# Altium schematic sheet led_frontend.SchDoc: SDL - LED frontend
size Letter; Author: Ye-Sheng Kuo; Revision: 1; SheetNumber: 1; SheetTotal: 1
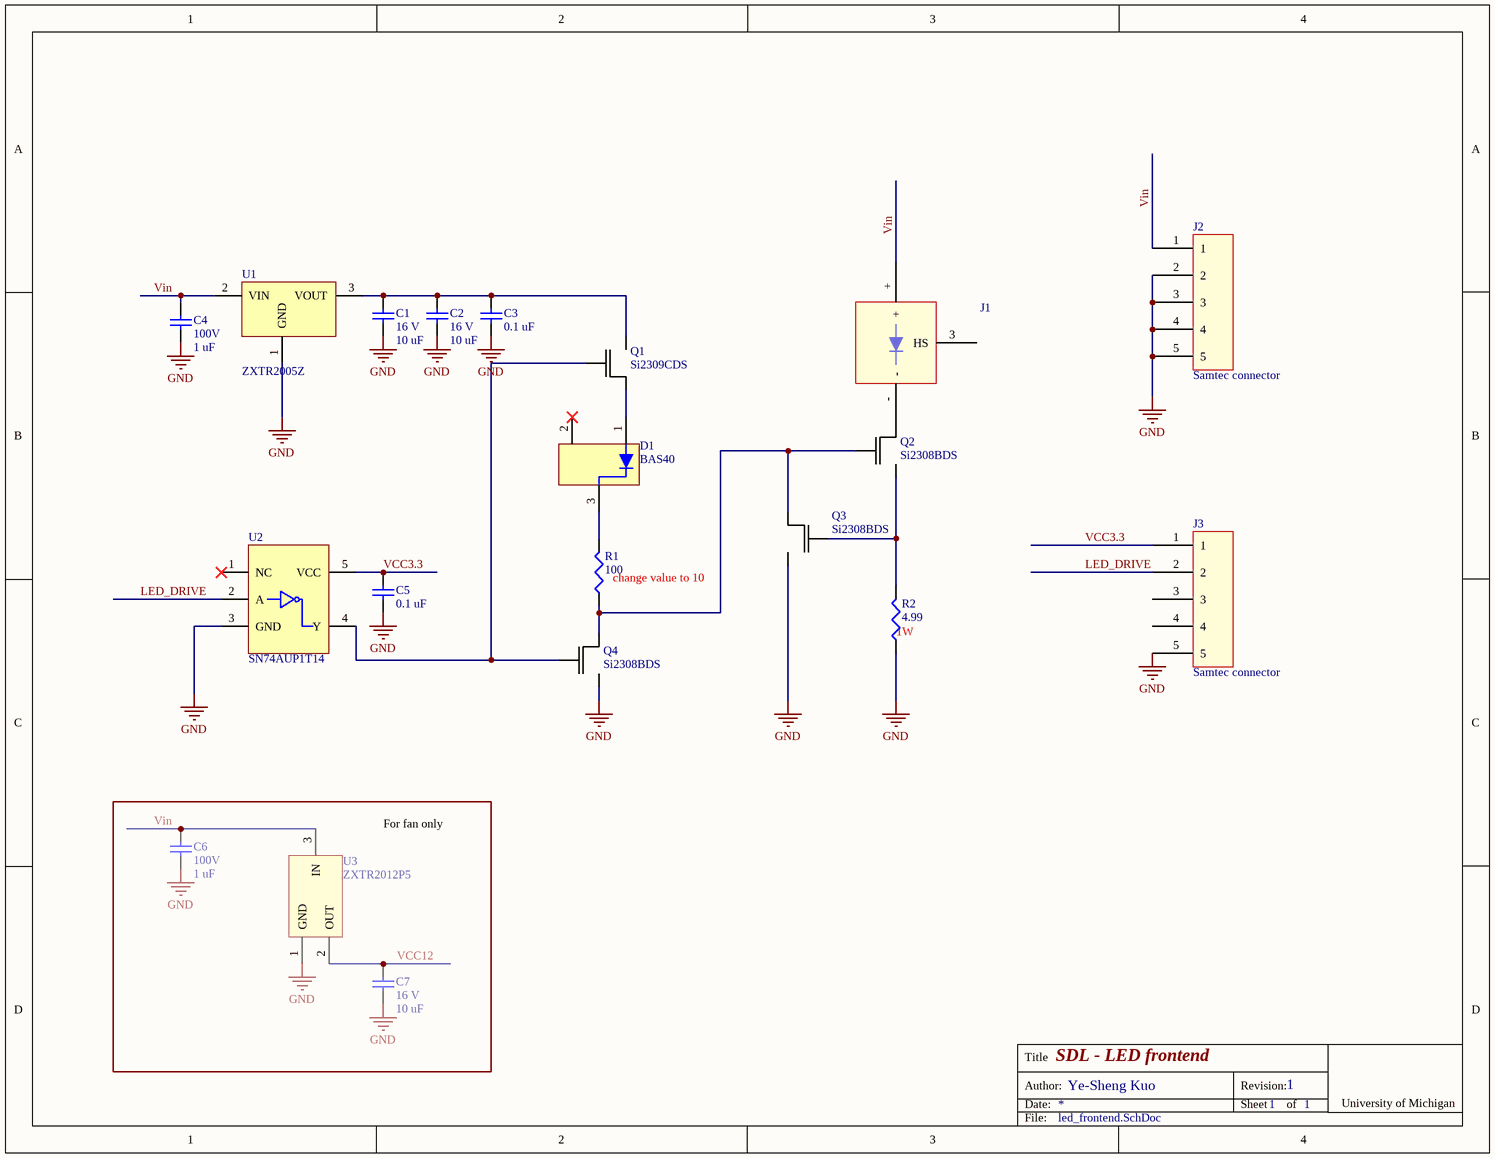
[diagram p0: led_frontend.SchDoc]

## Parts
C1  value 10 uF  voltage rated: 16 V  [0603]  (hidden comment: Ceramic capacitor)
C2  value 10 uF  voltage rated: 16 V  [0603]  (hidden comment: Ceramic capacitor)
C3  value 0.1 uF  [0603]  (hidden comment: Ceramic capacitor)
C4  value 1 uF  voltage rated: 100V  [0805]  (hidden comment: Ceramic capacitor)
C5  value 0.1 uF  [0603]  (hidden comment: Ceramic capacitor)
C6  value 1 uF  voltage rated: 100V  [0805]  (hidden comment: Ceramic capacitor)
C7  value 10 uF  voltage rated: 16 V  [0603]  (hidden comment: Ceramic capacitor)
D1  BAS40  [SOT23-3]
J1  1807200002  [molex]  (value not drawn)
J2  Samtec connector  [TFM-105-02-L-S]
J3  Samtec connector  [TFM-105-02-L-S]
Q1  Si2309CDS  [SOT23-3]
Q2  Si2308BDS  [SOT23-3]
Q3  Si2308BDS  [SOT23-3]
Q4  Si2308BDS  [SOT23-3]
R1  value 100  [0603]  (hidden comment: Chip resistor)
R2  value 4.99  [2512]  (hidden comment: Chip resistor)
U1  ZXTR2005Z  [SOT89]
U2  SN74AUP1T14  [SC-70-5 (DCK)]
U3  ZXTR2012P5  [PowerDI-5]

## Nets
GND: C1.2 C2.2 C3.2 C4.2 C5.2 C6.2 C7.2 J2.2 J2.3 J2.4 J2.5 J3.5 Q3.2(S) Q4.2(S) R2.2 U1.1(GND) U2.3(GND) U3.1(GND)
LED_DRIVE: J3.2 U2.2(A)
VCC3.3: C5.1 J3.1 U2.5(VCC)
VCC12: C7.1 U3.2(OUT)
Vin: C4.1 C6.1 J1.+ J2.1 U1.2(VIN) U3.3(IN)
NetC1_1: C1.1 C2.1 C3.1 Q1.2(S) U1.3(VOUT)
NetD1_1: D1.1 Q1.3(D)
NetD1_3: D1.3 R1.1
NetJ1_-: J1.- Q2.3(D)
NetQ1_1: Q1.1(G) Q4.1(G) U2.4(Y)
NetQ2_1: Q2.1(G) Q3.3(D) Q4.3(D) R1.2
NetQ2_2: Q2.2(S) Q3.1(G) R2.1

Not connected (* = marked no-connect by the designer): D1 2*; J1 3(HS); J3 3 4; U2 1(NC)*

## Notes on the sheet
- (near R1) change value to 10
- (near R2) 1W
- For fan only
- Title
- Date:
- Author:
- Revision:
- Sheet
- of
- University of Michigan
- File:

## Library data of the parts
C1 C2 C7 = C_10u_16V_0603_ceramic: Ceramic capacitor, 10 uF, 16 V, 0603 package; Manufacture: TDK; tolerance: 20%; Temperature Coefficient: X5R; package: 0603; Supplier 1: Digi-Key; Supplier Part Number 1: 445-9065-6-ND
C3 C5 = C_0.1u_0603_ceramic: Ceramic capacitor, 0.1 uF, 0603 package; Manufacture: TDK; voltage rated: 25V; tolerance: 10%; package: 0603; Supplier 1: Digi-Key; Supplier Part Number 1: 445-1316-1-ND
C4 C6 = C_1u_100V_0805_ceramic: Ceramic capacitor, 1 uF, 100 V, 0805 package; Manufacture: TDK; tolerance: 10%; Temperature Coefficient: X7S; package: 0805; Supplier 1: Digi-Key; Supplier Part Number 1: 445-5205-1-ND
D1 = BAS40: SURFACE MOUNT SCHOTTKY BARRIER DIODE; Supplier 1: Digi-Key; Supplier Part Number 1: BAS40-FDICT-ND
J1 = Molex LED holder: LED Array Holders  for CREE* XLamp†   Arrays; Supplier 1: Digi-Key; Supplier Part Number 1: WM10352-ND
J2 J3 = Samtec conntector: Samtec connector, 1.27 mm, single row, 5 pos SMD; Supplier 1: Samtec
Q1 = Si2309CDS: P-Channel 60-V (D-S) MOSFET; Supplier 1: Digi-Key; Supplier Part Number 1: SI2309CDS-T1-E3CT-ND
Q2-Q4 = Si2308BDS: N-Channel 60-V (D-S) MOSFET; Supplier 1: Digi-Key; Supplier Part Number 1: SI2308BDS-T1-E3CT-ND
R1 = R_100_0603: Chip resistor, 100,  0603 package; tolerance: 0.1%; power: 1/1 W; Temperature Coefficient: 25 ppm; package: 0603; Supplier 1: Digi-Key; Supplier Part Number 1: TNP100AACT-ND
R2 = R_4.99_2512: Chip resistor, 4.99, 2512 package; tolerance: 1%; power: 1 W; Temperature Coefficient: 100 ppm; package: 2512; Supplier 1: Digi-Key; Supplier Part Number 1: 541-4.99AFCT-ND
U1 = ZXTR2005Z: 100V INPUT, 5V 30mA REGULATOR TRANSISTOR; Supplier 1: Digi-Key; Supplier Part Number 1: ZXTR2005Z-13DICT-ND
U2 = SN74AUP1T14: LOW POWER, 1.8/2.5/3.3-V INPUT, 3.3-V CMOS OUTPUT, SINGLE  SCHMITT-TRIGGER INVERTER GATE; Supplier 1: Digi-Key; Supplier Part Number 1: 296-27392-1-ND
U3 = ZXTR2012P5: 100V INPUT, 12V 40mA REGULATOR TRANSISTOR; Supplier 1: Digi-Key; Supplier Part Number 1: ZXTR2012P5-13DICT-ND